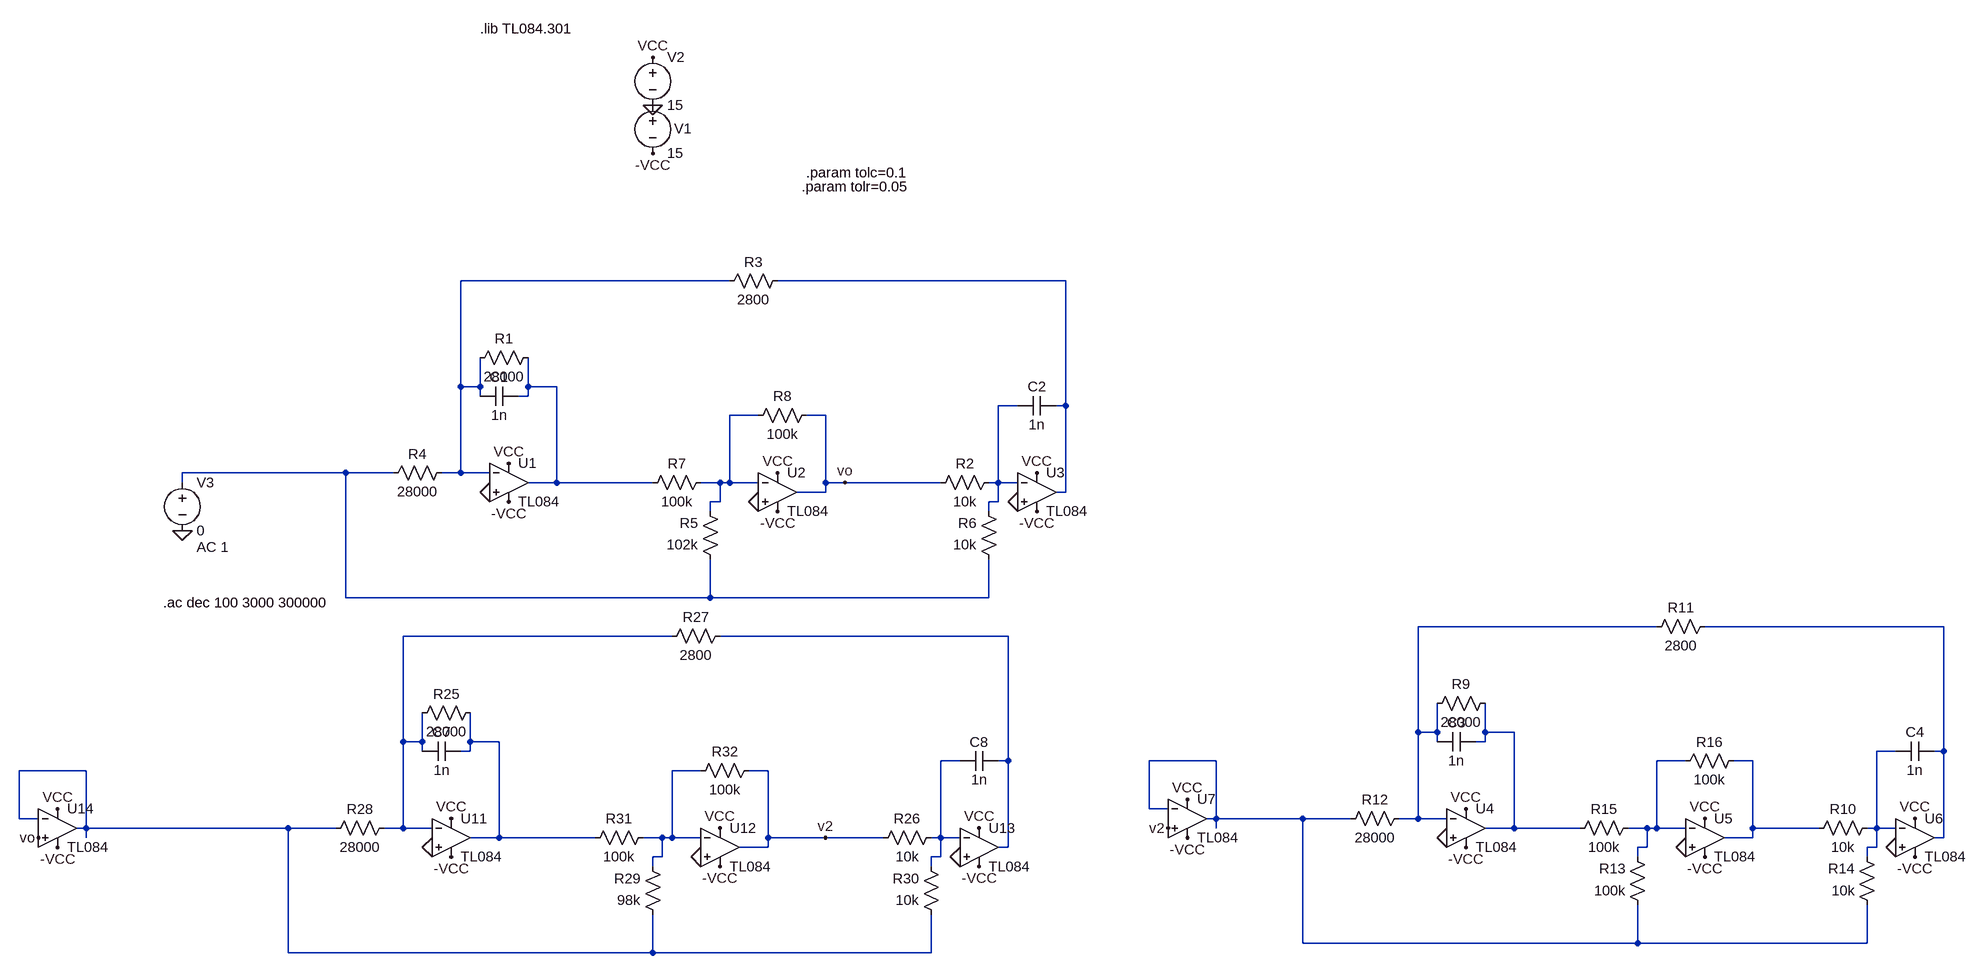
[diagram p0: schematic CEKL sm.asc]
CEKL sm.asc, the LTspice schematic file:
Version 4
SHEET 1 4184 1368
WIRE 656 224 208 224
WIRE 1216 224 736 224
WIRE 208 400 208 224
WIRE 240 400 240 352
WIRE 240 400 208 400
WIRE 320 400 320 352
WIRE 368 400 320 400
WIRE 240 416 240 400
WIRE 320 416 320 400
WIRE 320 416 304 416
WIRE 1136 432 1104 432
WIRE 1216 432 1216 224
WIRE 1216 432 1200 432
WIRE 704 448 656 448
WIRE 816 448 784 448
WIRE 16 544 -256 544
WIRE 96 544 16 544
WIRE 208 544 208 400
WIRE 208 544 176 544
WIRE 256 544 208 544
WIRE -256 560 -256 544
WIRE 368 560 368 400
WIRE 368 560 320 560
WIRE 528 560 368 560
WIRE 640 560 608 560
WIRE 656 560 656 448
WIRE 656 560 640 560
WIRE 704 560 656 560
WIRE 816 560 816 448
WIRE 848 560 816 560
WIRE 1008 560 848 560
WIRE 1104 560 1104 432
WIRE 1104 560 1088 560
WIRE 1136 560 1104 560
WIRE 816 576 816 560
WIRE 816 576 768 576
WIRE 1216 576 1216 432
WIRE 1216 576 1200 576
WIRE 640 592 640 560
WIRE 640 592 624 592
WIRE 1104 592 1104 560
WIRE 1104 592 1088 592
WIRE 624 608 624 592
WIRE 1088 608 1088 592
WIRE 16 752 16 544
WIRE 624 752 624 688
WIRE 624 752 16 752
WIRE 1088 752 1088 688
WIRE 1088 752 624 752
WIRE 2448 800 2000 800
WIRE 3008 800 2528 800
WIRE 560 816 112 816
WIRE 1120 816 640 816
WIRE 2000 976 2000 800
WIRE 2032 976 2032 928
WIRE 2032 976 2000 976
WIRE 2112 976 2112 928
WIRE 2160 976 2112 976
WIRE 112 992 112 816
WIRE 144 992 144 944
WIRE 144 992 112 992
WIRE 224 992 224 944
WIRE 272 992 224 992
WIRE 2032 992 2032 976
WIRE 2112 992 2112 976
WIRE 2112 992 2096 992
WIRE 144 1008 144 992
WIRE 224 1008 224 992
WIRE 224 1008 208 1008
WIRE 2928 1008 2896 1008
WIRE 3008 1008 3008 800
WIRE 3008 1008 2992 1008
WIRE 1040 1024 1008 1024
WIRE 1120 1024 1120 816
WIRE 1120 1024 1104 1024
WIRE 1472 1024 1360 1024
WIRE 2496 1024 2448 1024
WIRE 2608 1024 2576 1024
WIRE -416 1040 -528 1040
WIRE 608 1040 560 1040
WIRE 720 1040 688 1040
WIRE 1360 1104 1360 1024
WIRE 1392 1104 1360 1104
WIRE -528 1120 -528 1040
WIRE -496 1120 -528 1120
WIRE 1472 1120 1472 1024
WIRE 1472 1120 1456 1120
WIRE 1808 1120 1472 1120
WIRE 1888 1120 1808 1120
WIRE 2000 1120 2000 976
WIRE 2000 1120 1968 1120
WIRE 2048 1120 2000 1120
WIRE -416 1136 -416 1040
WIRE -416 1136 -432 1136
WIRE -80 1136 -416 1136
WIRE 0 1136 -80 1136
WIRE 112 1136 112 992
WIRE 112 1136 80 1136
WIRE 160 1136 112 1136
WIRE 1472 1136 1472 1120
WIRE 2160 1136 2160 976
WIRE 2160 1136 2112 1136
WIRE 2320 1136 2160 1136
WIRE 2432 1136 2400 1136
WIRE 2448 1136 2448 1024
WIRE 2448 1136 2432 1136
WIRE 2496 1136 2448 1136
WIRE 2608 1136 2608 1024
WIRE 2800 1136 2608 1136
WIRE 2896 1136 2896 1008
WIRE 2896 1136 2880 1136
WIRE 2928 1136 2896 1136
WIRE -416 1152 -416 1136
WIRE 272 1152 272 992
WIRE 272 1152 224 1152
WIRE 432 1152 272 1152
WIRE 544 1152 512 1152
WIRE 560 1152 560 1040
WIRE 560 1152 544 1152
WIRE 608 1152 560 1152
WIRE 720 1152 720 1040
WIRE 816 1152 720 1152
WIRE 912 1152 816 1152
WIRE 1008 1152 1008 1024
WIRE 1008 1152 992 1152
WIRE 1040 1152 1008 1152
WIRE 2608 1152 2608 1136
WIRE 2608 1152 2560 1152
WIRE 3008 1152 3008 1008
WIRE 3008 1152 2992 1152
WIRE 720 1168 720 1152
WIRE 720 1168 672 1168
WIRE 1120 1168 1120 1024
WIRE 1120 1168 1104 1168
WIRE 2432 1168 2432 1136
WIRE 2432 1168 2416 1168
WIRE 2896 1168 2896 1136
WIRE 2896 1168 2880 1168
WIRE 544 1184 544 1152
WIRE 544 1184 528 1184
WIRE 1008 1184 1008 1152
WIRE 1008 1184 992 1184
WIRE 2416 1184 2416 1168
WIRE 2880 1184 2880 1168
WIRE 528 1200 528 1184
WIRE 992 1200 992 1184
WIRE 1808 1328 1808 1120
WIRE 2416 1328 2416 1264
WIRE 2416 1328 1808 1328
WIRE 2880 1328 2880 1264
WIRE 2880 1328 2416 1328
WIRE -80 1344 -80 1136
WIRE 528 1344 528 1280
WIRE 528 1344 -80 1344
WIRE 992 1344 992 1280
WIRE 992 1344 528 1344
FLAG 288 528 VCC
FLAG 528 -272 VCC
FLAG 288 592 -VCC
FLAG 528 -112 -VCC
FLAG 528 -192 0
FLAG 256 576 0
FLAG -256 640 0
FLAG 736 544 VCC
FLAG 736 608 -VCC
FLAG 704 592 0
FLAG 1168 544 VCC
FLAG 1168 608 -VCC
FLAG 1136 592 0
FLAG 848 560 vo
FLAG 192 1120 VCC
FLAG 192 1184 -VCC
FLAG 160 1168 0
FLAG 640 1136 VCC
FLAG 640 1200 -VCC
FLAG 608 1184 0
FLAG 1072 1136 VCC
FLAG 1072 1200 -VCC
FLAG 1040 1184 0
FLAG -464 1104 VCC
FLAG -464 1168 -VCC
FLAG -496 1152 vo
FLAG 2080 1104 VCC
FLAG 2080 1168 -VCC
FLAG 2048 1152 0
FLAG 2528 1120 VCC
FLAG 2528 1184 -VCC
FLAG 2496 1168 0
FLAG 2960 1120 VCC
FLAG 2960 1184 -VCC
FLAG 2928 1168 0
FLAG 1424 1088 VCC
FLAG 1424 1152 -VCC
FLAG 816 1152 v2
FLAG 1392 1136 v2
SYMBOL Opamps\\opamp2 288 496 R0
SYMATTR InstName U1
SYMATTR Value TL084
SYMBOL voltage 528 -208 R0
WINDOW 0 36 55 Left 2
WINDOW 123 0 0 Left 2
WINDOW 39 0 0 Left 2
SYMATTR InstName V1
SYMATTR Value 15
SYMBOL voltage 528 -288 R0
WINDOW 123 0 0 Left 2
WINDOW 39 0 0 Left 2
SYMATTR InstName V2
SYMATTR Value 15
SYMBOL voltage -256 544 R0
WINDOW 123 24 124 Left 2
WINDOW 39 0 0 Left 2
SYMATTR Value2 AC 1
SYMATTR InstName V3
SYMATTR Value 0
SYMBOL Opamps\\opamp2 736 512 R0
SYMATTR InstName U2
SYMATTR Value TL084
SYMBOL Opamps\\opamp2 1168 512 R0
SYMATTR InstName U3
SYMATTR Value TL084
SYMBOL res 336 336 R90
WINDOW 0 0 56 VBottom 2
WINDOW 3 32 56 VTop 2
SYMATTR InstName R1
SYMATTR Value 28000
SYMBOL res 1104 544 R90
WINDOW 0 0 56 VBottom 2
WINDOW 3 32 56 VTop 2
SYMATTR InstName R2
SYMATTR Value 10k
SYMBOL res 752 208 R90
WINDOW 0 0 56 VBottom 2
WINDOW 3 32 56 VTop 2
SYMATTR InstName R3
SYMATTR Value 2800
SYMBOL res 192 528 R90
WINDOW 0 0 56 VBottom 2
WINDOW 3 32 56 VTop 2
SYMATTR InstName R4
SYMATTR Value 28000
SYMBOL res 640 704 R180
WINDOW 0 36 76 Left 2
WINDOW 3 36 40 Left 2
SYMATTR InstName R5
SYMATTR Value 102k
SYMBOL res 1104 704 R180
WINDOW 0 36 76 Left 2
WINDOW 3 36 40 Left 2
SYMATTR InstName R6
SYMATTR Value 10k
SYMBOL res 512 576 R270
WINDOW 0 32 56 VTop 2
WINDOW 3 0 56 VBottom 2
SYMATTR InstName R7
SYMATTR Value 100k
SYMBOL res 688 464 R270
WINDOW 0 32 56 VTop 2
WINDOW 3 0 56 VBottom 2
SYMATTR InstName R8
SYMATTR Value 100k
SYMBOL cap 304 400 R90
WINDOW 0 0 32 VBottom 2
WINDOW 3 32 32 VTop 2
SYMATTR InstName C1
SYMATTR Value 1n
SYMBOL cap 1200 416 R90
WINDOW 0 0 32 VBottom 2
WINDOW 3 32 32 VTop 2
SYMATTR InstName C2
SYMATTR Value 1n
SYMBOL Opamps\\opamp2 192 1088 R0
SYMATTR InstName U11
SYMATTR Value TL084
SYMBOL Opamps\\opamp2 640 1104 R0
SYMATTR InstName U12
SYMATTR Value TL084
SYMBOL Opamps\\opamp2 1072 1104 R0
SYMATTR InstName U13
SYMATTR Value TL084
SYMBOL res 240 928 R90
WINDOW 0 0 56 VBottom 2
WINDOW 3 32 56 VTop 2
SYMATTR InstName R25
SYMATTR Value 28000
SYMBOL res 1008 1136 R90
WINDOW 0 0 56 VBottom 2
WINDOW 3 32 56 VTop 2
SYMATTR InstName R26
SYMATTR Value 10k
SYMBOL res 656 800 R90
WINDOW 0 0 56 VBottom 2
WINDOW 3 32 56 VTop 2
SYMATTR InstName R27
SYMATTR Value 2800
SYMBOL res 96 1120 R90
WINDOW 0 0 56 VBottom 2
WINDOW 3 32 56 VTop 2
SYMATTR InstName R28
SYMATTR Value 28000
SYMBOL res 544 1296 R180
WINDOW 0 36 76 Left 2
WINDOW 3 36 40 Left 2
SYMATTR InstName R29
SYMATTR Value 98k
SYMBOL res 1008 1296 R180
WINDOW 0 36 76 Left 2
WINDOW 3 36 40 Left 2
SYMATTR InstName R30
SYMATTR Value 10k
SYMBOL res 416 1168 R270
WINDOW 0 32 56 VTop 2
WINDOW 3 0 56 VBottom 2
SYMATTR InstName R31
SYMATTR Value 100k
SYMBOL res 592 1056 R270
WINDOW 0 32 56 VTop 2
WINDOW 3 0 56 VBottom 2
SYMATTR InstName R32
SYMATTR Value 100k
SYMBOL cap 208 992 R90
WINDOW 0 0 32 VBottom 2
WINDOW 3 32 32 VTop 2
SYMATTR InstName C7
SYMATTR Value 1n
SYMBOL cap 1104 1008 R90
WINDOW 0 0 32 VBottom 2
WINDOW 3 32 32 VTop 2
SYMATTR InstName C8
SYMATTR Value 1n
SYMBOL Opamps\\opamp2 -464 1072 R0
SYMATTR InstName U14
SYMATTR Value TL084
SYMBOL Opamps\\opamp2 2080 1072 R0
SYMATTR InstName U4
SYMATTR Value TL084
SYMBOL Opamps\\opamp2 2528 1088 R0
SYMATTR InstName U5
SYMATTR Value TL084
SYMBOL Opamps\\opamp2 2960 1088 R0
SYMATTR InstName U6
SYMATTR Value TL084
SYMBOL res 2128 912 R90
WINDOW 0 0 56 VBottom 2
WINDOW 3 32 56 VTop 2
SYMATTR InstName R9
SYMATTR Value 28000
SYMBOL res 2896 1120 R90
WINDOW 0 0 56 VBottom 2
WINDOW 3 32 56 VTop 2
SYMATTR InstName R10
SYMATTR Value 10k
SYMBOL res 2544 784 R90
WINDOW 0 0 56 VBottom 2
WINDOW 3 32 56 VTop 2
SYMATTR InstName R11
SYMATTR Value 2800
SYMBOL res 1984 1104 R90
WINDOW 0 0 56 VBottom 2
WINDOW 3 32 56 VTop 2
SYMATTR InstName R12
SYMATTR Value 28000
SYMBOL res 2432 1280 R180
WINDOW 0 36 76 Left 2
WINDOW 3 36 40 Left 2
SYMATTR InstName R13
SYMATTR Value 100k
SYMBOL res 2896 1280 R180
WINDOW 0 36 76 Left 2
WINDOW 3 36 40 Left 2
SYMATTR InstName R14
SYMATTR Value 10k
SYMBOL res 2304 1152 R270
WINDOW 0 32 56 VTop 2
WINDOW 3 0 56 VBottom 2
SYMATTR InstName R15
SYMATTR Value 100k
SYMBOL res 2480 1040 R270
WINDOW 0 32 56 VTop 2
WINDOW 3 0 56 VBottom 2
SYMATTR InstName R16
SYMATTR Value 100k
SYMBOL cap 2096 976 R90
WINDOW 0 0 32 VBottom 2
WINDOW 3 32 32 VTop 2
SYMATTR InstName C3
SYMATTR Value 1n
SYMBOL cap 2992 992 R90
WINDOW 0 0 32 VBottom 2
WINDOW 3 32 32 VTop 2
SYMATTR InstName C4
SYMATTR Value 1n
SYMBOL Opamps\\opamp2 1424 1056 R0
SYMATTR InstName U7
SYMATTR Value TL084
TEXT 240 -320 Left 2 !.lib TL084.301
TEXT 776 -56 Left 2 !.param tolr=0.05
TEXT 784 -80 Left 2 !.param tolc=0.1
TEXT -288 760 Left 2 !.ac dec 100 3000 300000

The netlist it stands for:
* CEKL sm.asc
XU1 0 N001 VCC -VCC N003 TL084  ; pins In+ In- V+ V- OUT
V1 0 -VCC 15
V2 VCC 0 15
V3 N006 0 0 AC 1
XU2 0 N005 VCC -VCC vo TL084  ; pins In+ In- V+ V- OUT
XU3 0 N004 VCC -VCC N002 TL084  ; pins In+ In- V+ V- OUT
R1 N003 N001 28000
R2 N004 vo 10k
R3 N002 N001 2800
R4 N001 N006 28000
R5 N006 N005 102k
R6 N006 N004 10k
R7 N003 N005 100k
R8 N005 vo 100k
C1 N003 N001 1n
C2 N002 N004 1n
XU11 0 N009 VCC -VCC N012 TL084  ; pins In+ In- V+ V- OUT
XU12 0 N019 VCC -VCC v2 TL084  ; pins In+ In- V+ V- OUT
XU13 0 N014 VCC -VCC N010 TL084  ; pins In+ In- V+ V- OUT
R25 N012 N009 28000
R26 N014 v2 10k
R27 N010 N009 2800
R28 N009 N018 28000
R29 N018 N019 98k
R30 N018 N014 10k
R31 N012 N019 100k
R32 N019 v2 100k
C7 N012 N009 1n
C8 N010 N014 1n
XU14 vo N018 VCC -VCC N018 TL084  ; pins In+ In- V+ V- OUT
XU4 0 N007 VCC -VCC N011 TL084  ; pins In+ In- V+ V- OUT
XU5 0 N016 VCC -VCC N017 TL084  ; pins In+ In- V+ V- OUT
XU6 0 N013 VCC -VCC N008 TL084  ; pins In+ In- V+ V- OUT
R9 N011 N007 28000
R10 N013 N017 10k
R11 N008 N007 2800
R12 N007 N015 28000
R13 N015 N016 100k
R14 N015 N013 10k
R15 N011 N016 100k
R16 N016 N017 100k
C3 N011 N007 1n
C4 N008 N013 1n
XU7 v2 N015 VCC -VCC N015 TL084  ; pins In+ In- V+ V- OUT
.lib TL084.301
.param tolr=0.05
.param tolc=0.1
.ac dec 100 3000 300000
.backanno
.end